# EAGLE design MCU_v3 (EAGLE 7.1.0)
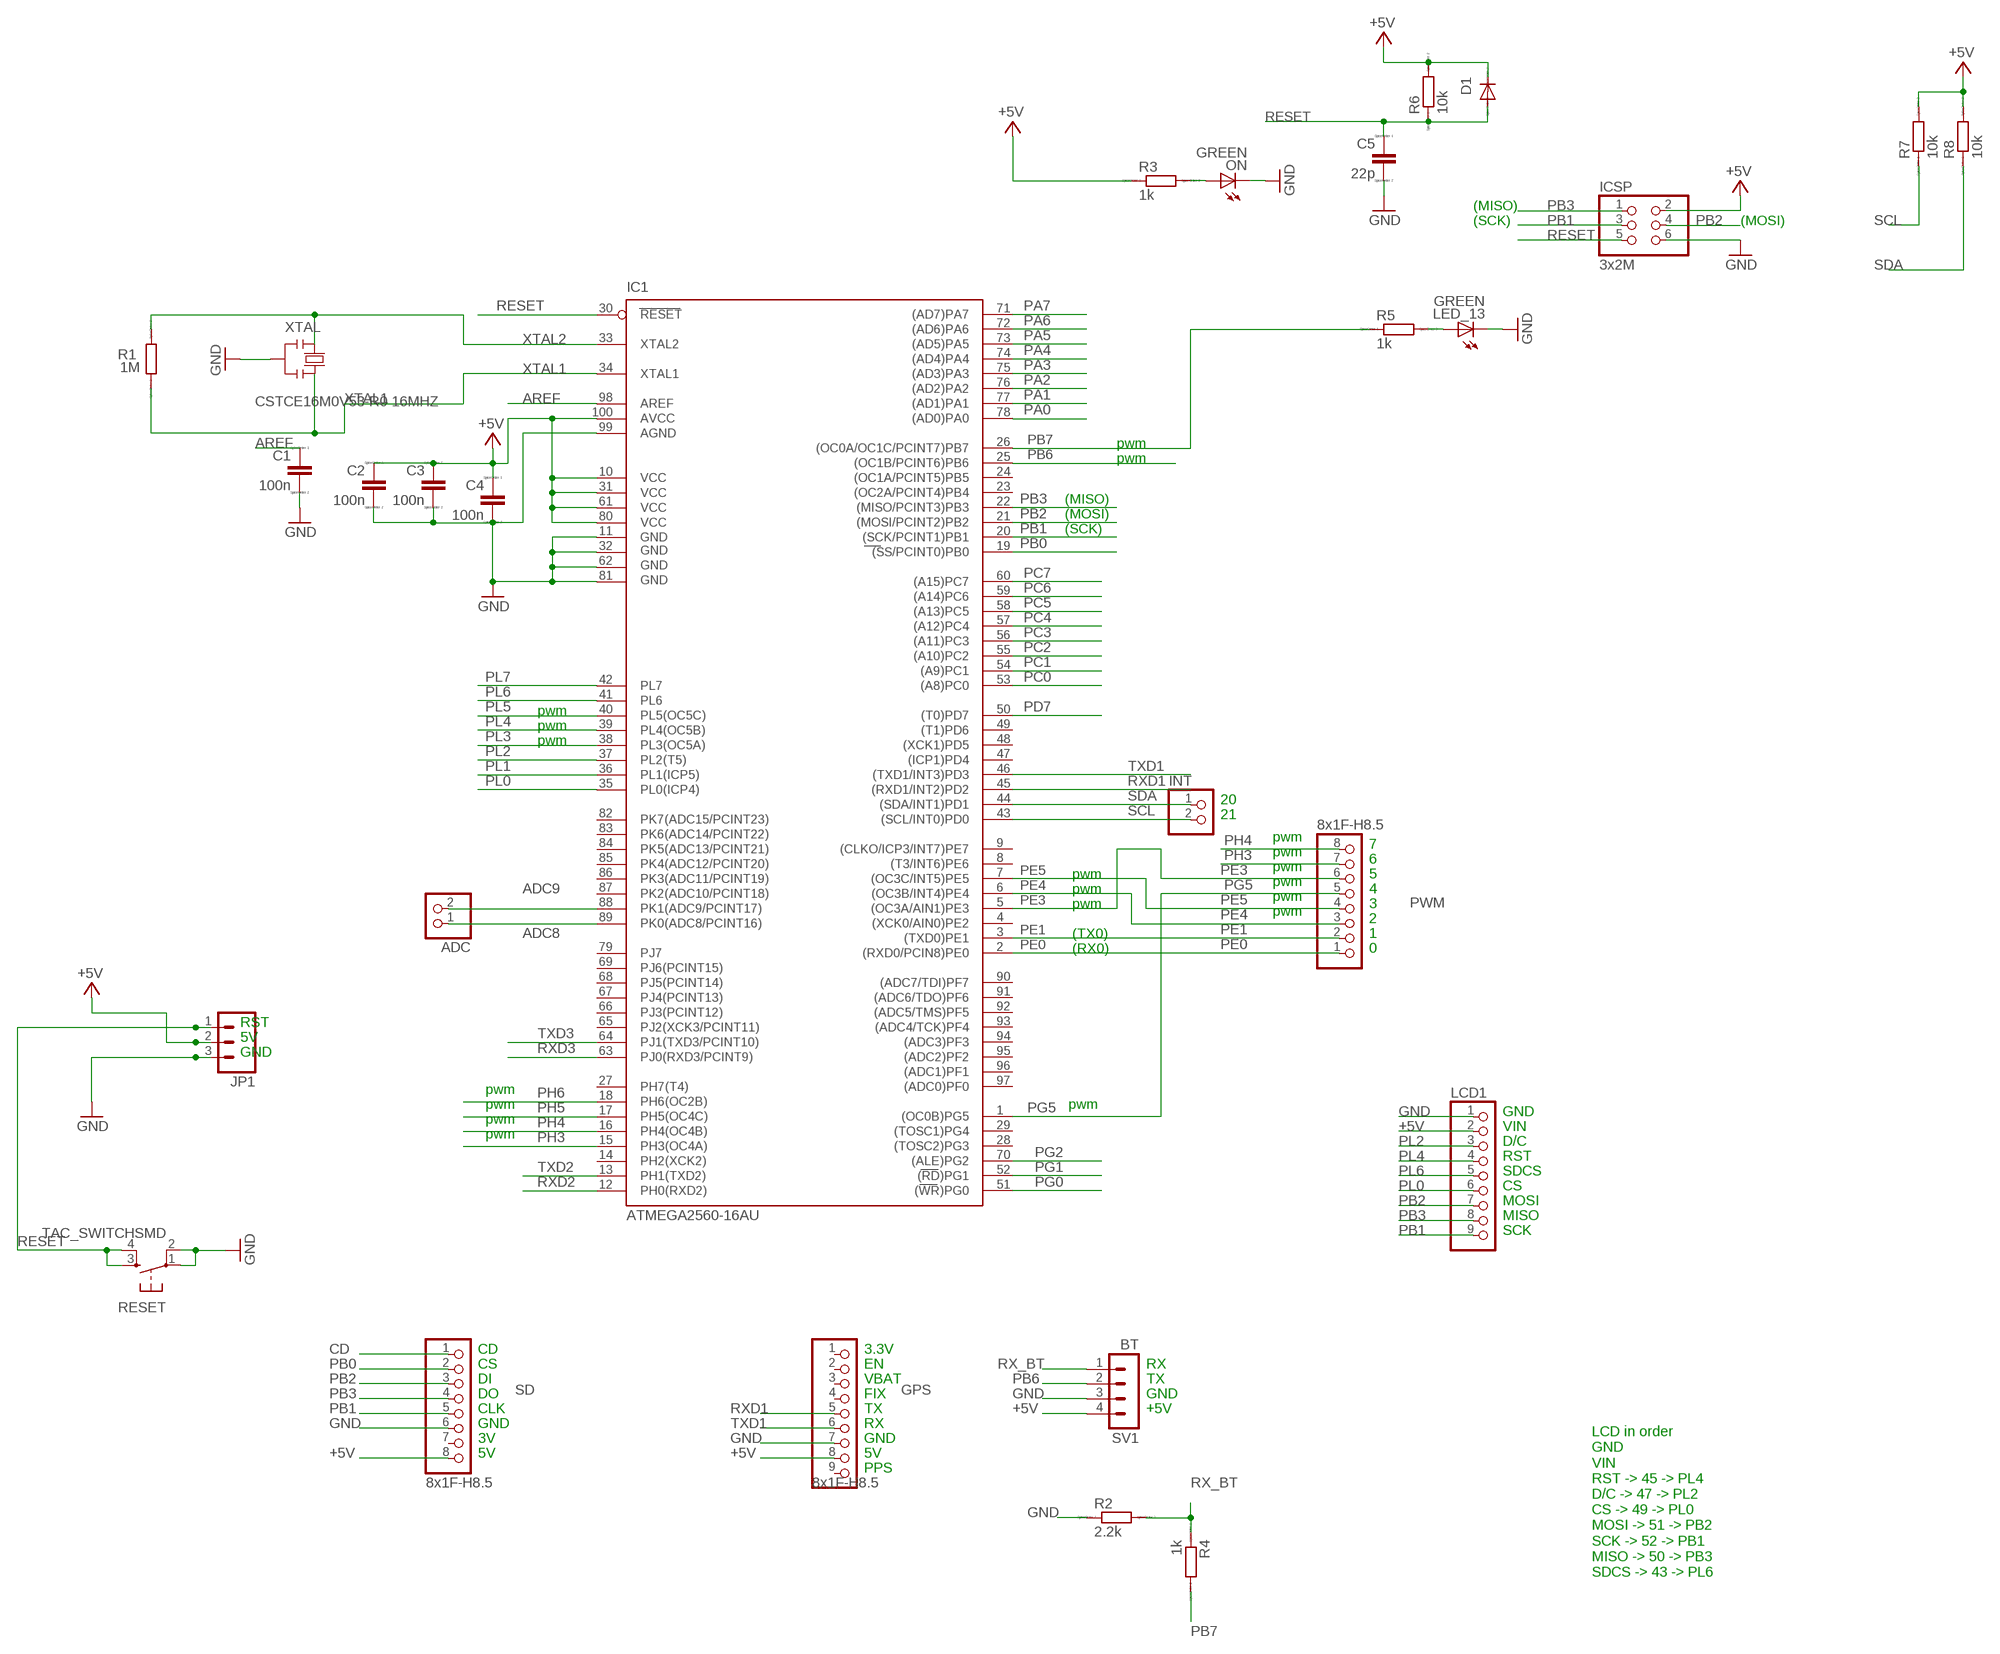
[diagram p0: schematic, sheet 1]

## Parts
ADC  PINHD-1X2  [1X02]
C1  100n  C-EUC0805  [C0805]
C2  100n  C-EUC0805  [C0805]
C3  100n  C-EUC0805  [C0805]
C4  100n  C-EUC0805  [C0805]
C5  22p  C-EUC0805  [C0805]
D1  DIODE-MINIMELF  [MINIMELF]
GPS  8x1F-H8.5  PINHD-1X9  [1X09]
IC1  ATMEGA2560-16AU  ATMEGA25602560-16AU  [TQFP100]
ICSP  3x2M  PINHD-2X3  [2X03]
INT  PINHD-1X2  [1X02]
JP1  M03PTH  [1X03]
LCD1  PINHD-1X9  [1X09]
LED_13  GREEN  LEDCHIP-LED0805  [CHIP-LED0805]
ON  GREEN  LEDCHIP-LED0805  [CHIP-LED0805]
PWM  8x1F-H8.5  PINHD-1X8  [1X08]
R1  1M  R-EU_R0805  [R0805]
R2  2.2k  R-EU_R0805  [R0805]
R3  1k  R-EU_R0805  [R0805]
R4  1k  R-EU_R0805  [R0805]
R5  1k  R-EU_R0805  [R0805]
R6  10k  R-EU_R0805  [R0805]
R7  10k  R-EU_R0805  [R0805]
R8  10k  R-EU_R0805  [R0805]
RESET  TAC_SWITCHSMD  [TACTILE-SWITCH-SMD]
SD  8x1F-H8.5  PINHD-1X8  [1X08]
SV1  BT  MA04-1  [MA04-1]
XTAL  CSTCE16M0V53-R0 16MHZ  RESONATORMU  [RESONATOR]

## Nets
+5V [power usb]: C2.1 C3.1 C4.1 D1.C GPS.8 IC1.10(VCC) IC1.31(VCC1) IC1.61(VCC2) IC1.80(VCC3) IC1.100(AVCC) ICSP.2 JP1.2 LCD1.2 R3.1 R6.2 R7.2 R8.2 SD.8 SV1.4
ADC8: ADC.1 IC1.89(PK0(ADC8/PCINT16))
ADC9: ADC.2 IC1.88(PK1(ADC9/PCINT17))
AREF: C1.1 IC1.98(AREF)
CD: SD.1
GND [gnd]: C1.2 C2.2 C3.2 C4.2 C5.2 GPS.7 IC1.11(GND) IC1.32(GND1) IC1.62(GND2) IC1.81(GND3) IC1.99(AGND) ICSP.6 JP1.3 LCD1.1 LED_13.C ON.C R2.1 RESET.1 RESET.2 SD.6 SV1.3 XTAL.2
N$1: LED_13.A R5.2
N$3: ON.A R3.2
PA0: IC1.78((AD0)PA0)
PA1: IC1.77((AD1)PA1)
PA2: IC1.76((AD2)PA2)
PA3: IC1.75((AD3)PA3)
PA4: IC1.74((AD4)PA4)
PA5: IC1.73((AD5)PA5)
PA6: IC1.72((AD6)PA6)
PA7: IC1.71((AD7)PA7)
PB0: IC1.19((SS/PCINT0)PB0) SD.2
PB1: IC1.20((SCK/PCINT1)PB1) ICSP.3 LCD1.9 SD.5
PB2: IC1.21((MOSI/PCINT2)PB2) ICSP.4 LCD1.7 SD.3
PB3: IC1.22((MISO/PCINT3)PB3) ICSP.1 LCD1.8 SD.4
PB6: IC1.25((OC1B/PCINT6)PB6) SV1.2
PB7: IC1.26((OC0A/OC1C/PCINT7)PB7) R4.2 R5.1
PC0: IC1.53((A8)PC0)
PC1: IC1.54((A9)PC1)
PC2: IC1.55((A10)PC2)
PC3: IC1.56((A11)PC3)
PC4: IC1.57((A12)PC4)
PC5: IC1.58((A13)PC5)
PC6: IC1.59((A14)PC6)
PC7: IC1.60((A15)PC7)
PD7: IC1.50((T0)PD7)
PE0: IC1.2((RXD0/PCIN8)PE0) PWM.1
PE1: IC1.3((TXD0)PE1) PWM.2
PE3: IC1.5((OC3A/AIN1)PE3) PWM.6
PE4: IC1.6((OC3B/INT4)PE4) PWM.3
PE5: IC1.7((OC3C/INT5)PE5) PWM.4
PG0: IC1.51((WR)PG0)
PG1: IC1.52((RD)PG1)
PG2: IC1.70((ALE)PG2)
PG5: IC1.1((OC0B)PG5) PWM.5
PH3: IC1.15(PH3(OC4A)) PWM.7
PH4: IC1.16(PH4(OC4B)) PWM.8
PH5: IC1.17(PH5(OC4C))
PH6: IC1.18(PH6(OC2B))
PL0: IC1.35(PL0(ICP4)) LCD1.6
PL1: IC1.36(PL1(ICP5))
PL2: IC1.37(PL2(T5)) LCD1.3
PL3: IC1.38(PL3(OC5A))
PL4: IC1.39(PL4(OC5B)) LCD1.4
PL5: IC1.40(PL5(OC5C))
PL6: IC1.41(PL6) LCD1.5
PL7: IC1.42(PL7)
RESET: C5.1 D1.A IC1.30(RESET) ICSP.5 JP1.1 R6.1 RESET.3 RESET.4
RX_BT: R2.2 R4.1 SV1.1
RXD1: GPS.5 IC1.45((RXD1/INT2)PD2)
RXD2: IC1.12(PH0(RXD2))
RXD3: IC1.63(PJ0(RXD3/PCINT9))
SCL: IC1.43((SCL/INT0)PD0) INT.2 R7.1
SDA: IC1.44((SDA/INT1)PD1) INT.1 R8.1
TXD1: GPS.6 IC1.46((TXD1/INT3)PD3)
TXD2: IC1.13(PH1(TXD2))
TXD3: IC1.64(PJ1(TXD3/PCINT10))
XTAL1: IC1.34(XTAL1) R1.1 XTAL.3
XTAL2: IC1.33(XTAL2) R1.2 XTAL.1
Unconnected: GPS.1 GPS.2 GPS.3 GPS.4 GPS.9 IC1.4((XCK0/AIN0)PE2) IC1.8((T3/INT6)PE6) IC1.9((CLKO/ICP3/INT7)PE7) IC1.14(PH2(XCK2)) IC1.23((OC2A/PCINT4)PB4) IC1.24((OC1A/PCINT5)PB5) IC1.27(PH7(T4)) IC1.28((TOSC2)PG3) IC1.29((TOSC1)PG4) IC1.47((ICP1)PD4) IC1.48((XCK1)PD5) IC1.49((T1)PD6) IC1.65(PJ2(XCK3/PCINT11)) IC1.66(PJ3(PCINT12)) IC1.67(PJ4(PCINT13)) IC1.68(PJ5(PCINT14)) IC1.69(PJ6(PCINT15)) IC1.79(PJ7) IC1.82(PK7(ADC15/PCINT23)) IC1.83(PK6(ADC14/PCINT22)) IC1.84(PK5(ADC13/PCINT21)) IC1.85(PK4(ADC12/PCINT20)) IC1.86(PK3(ADC11/PCINT19)) IC1.87(PK2(ADC10/PCINT18)) IC1.90((ADC7/TDI)PF7) IC1.91((ADC6/TDO)PF6) IC1.92((ADC5/TMS)PF5) IC1.93((ADC4/TCK)PF4) IC1.94((ADC3)PF3) IC1.95((ADC2)PF2) IC1.96((ADC1)PF1) IC1.97((ADC0)PF0) SD.7

## Notes on the sheet
- (MISO)
- (SCK) | (MOSI)
- pwm
- pwm
- (MISO)
- (MOSI)
- (SCK)
- pwm
- pwm
- pwm
- 20
- 21
- pwm
- 7
- pwm
- 6
- pwm
- pwm | 5
- pwm
- pwm | 4
- pwm
- pwm | 3
- pwm
- 2
- (TX0) | 1
- (RX0) | 0
- RST
- 5V
- GND
- pwm
- pwm | pwm
- GND
- pwm
- VIN
- pwm
- D/C
- RST
- SDCS
- CS
- MOSI
- MISO
- SCK
- CD | 3.3V
- CS | EN | RX
- DI | VBAT | TX
- DO | FIX | GND
- CLK | TX | +5V
- GND | RX
- 3V | GND
- 5V | 5V
- PPS
- LCD in order
  GND
  VIN
  RST -> 45 -> PL4
  D/C -> 47 -> PL2
  CS -> 49 -> PL0
  MOSI -> 51 -> PB2
  SCK -> 52 -> PB1
  MISO -> 50 -> PB3
  SDCS -> 43 -> PL6

## Library data of the parts
ADC INT = pinhead:PINHD-1X2: PIN HEADER; MPN: A21-X0-22-507-115-E; OC_NEWARK: 01Y3075
C1-C5 = resistor:C-EU: CAPACITOR, European symbol; OC_NEWARK: unknown; SPICEPREFIX: C
D1 = diode:DIODE-: DIODE; OC_NEWARK: unknown
GPS LCD1 = pinhead:PINHD-1X9: PIN HEADER; OC_NEWARK: unknown
IC1 = SmartPrj:ATMEGA2560: MICROCONTROLLER 64/128/256 Kbytes FLASH 4 Kbytes EEPROM 8 Kbytes SRAM 86 General Purpose I/O pins 12-channels16-bit PWM 4 x Serial USARTs 16-channels 10-bit A/D; OC_NEWARK: unknown
ICSP = SmartPrj:PINHD-2X3: PIN HEADER; OC_NEWARK: unknown
JP1 = SparkFun-Connectors:M03: Header 3 Standard 3-pin 0.1" header. Use with straight break away headers (SKU : PRT-00116), right angle break away headers (PRT-00553), swiss pins (PRT-00743), machine pins (PRT-00117), and female headers (PRT-00115). Molex polarized connector foot print use with SKU : PRT-08232 with associated crimp pins and housings.; MPN: BI2-Q10S-AZ31X-0.3M-SB3T; OC_NEWARK: 31Y7711
LED_13 ON = led:LED: LED OSRAM: - CHIPLED LG R971, LG N971, LY N971, LG Q971, LY Q971, LO R971, LY R971 LH N974, LH R974 LS Q976, LO Q976, LY Q976 LO Q996 - Hyper CHIPLED LW Q18S LB Q993, LB Q99A, LB R99A - SideLED LS A670, LO A670, LY A670, LG A670, LP A670 LB A673, LV A673, LT A673, LW A673 LH A674 LY A675 LS A676, LA A676, LO A676, LY A676, LW A676 LS A679, LY A679, LG A679 - Hyper Micro SIDELED® LS Y876, LA Y876, LO Y876, LY Y876 LT Y87S - SmartLED LW L88C, LW L88S LB L89C, LB L89S, LG L890 LS L89K, LO L89K, LY L89K LS L896, LA L896, LO L896, LY L896 - TOPLED LS T670, LO T670, LY T670, LG T670, LP T670 LSG T670, LSP T670, LSY T670, LOP T670, LYG T670 LG T671, LOG T671, LSG T671 LB T673, LV T673, LT T673, LW T673 LH T674 LS T676, LA T676, LO T676, LY T676, LB T676, LH T676, LSB T676, LW T676 LB T67C, LV T67C, LT T67C, LS T67K, LO T67K, LY T67K, LW E67C LS E67B, LA E67B, LO E67B, LY E67B, LB E67C, LV E67C, LT E67C LW T67C LS T679, LY T679, LG T679 LS T770, LO T770, LY T770, LG T770, LP T770 LB T773, LV T773, LT T773, LW T773 LH T774 LS E675, LA E675, LY E675, LS T675 LS T776, LA T776, LO T776, LY T776, LB T776 LHGB T686 LT T68C, LB T68C - Hyper Mini TOPLED® LB M676 - Mini TOPLED Santana® LG M470 LS M47K, LO M47K, LY M47K Source: http://www.osram.convergy.de LUXEON: - LUMILED® LXK2-PW12-R00, LXK2-PW12-S00, LXK2-PW14-U00, LXK2-PW14-V00 LXK2-PM12-R00, LXK2-PM12-S00, LXK2-PM14-U00 LXK2-PE12-Q00, LXK2-PE12-R00, LXK2-PE12-S00, LXK2-PE14-T00, LXK2-PE14-U00 LXK2-PB12-K00, LXK2-PB12-L00, LXK2-PB12-M00, LXK2-PB14-N00, LXK2-PB14-P00, LXK2-PB14-Q00 LXK2-PR12-L00, LXK2-PR12-M00, LXK2-PR14-Q00, LXK2-PR14-R00 LXK2-PD12-Q00, LXK2-PD12-R00, LXK2-PD12-S00 LXK2-PH12-R00, LXK2-PH12-S00 LXK2-PL12-P00, LXK2-PL12-Q00, LXK2-PL12-R00 Source: www.luxeon.com KINGBRIGHT: KA-3528ASYC Source: www.kingbright.com; OC_NEWARK: unknown
PWM SD = SmartPrj:PINHD-1X8: PIN HEADER; OC_NEWARK: unknown
R1-R8 = resistor:R-EU_: RESISTOR, European symbol; OC_NEWARK: unknown; SPICEPREFIX: R
RESET = SparkFun-Retired:TAC_SWITCH: Momentary Switch Button commonly used for reset or general input. Spark Fun Electronics SKU : COM-00097 SMT- SWCH-08247; OC_NEWARK: unknown; PROD_ID: SWCH-08247
SV1 = con-lstb:MA04-1: PIN HEADER; OC_FARNELL: unknown; OC_NEWARK: unknown
XTAL = SmartPrj:RESONATOR; OC_NEWARK: unknown

## Net classes
0 default: width 0.203 mm, drill 0.406 mm, clearance 0.203 mm
1 power: width 0.305 mm, drill 0.406 mm, clearance 0.203 mm
2 gnd: width 0.305 mm, drill 0.406 mm, clearance 0.203 mm
3 power usb: width 0.305 mm, drill 0.406 mm, clearance 0.203 mm

## Board
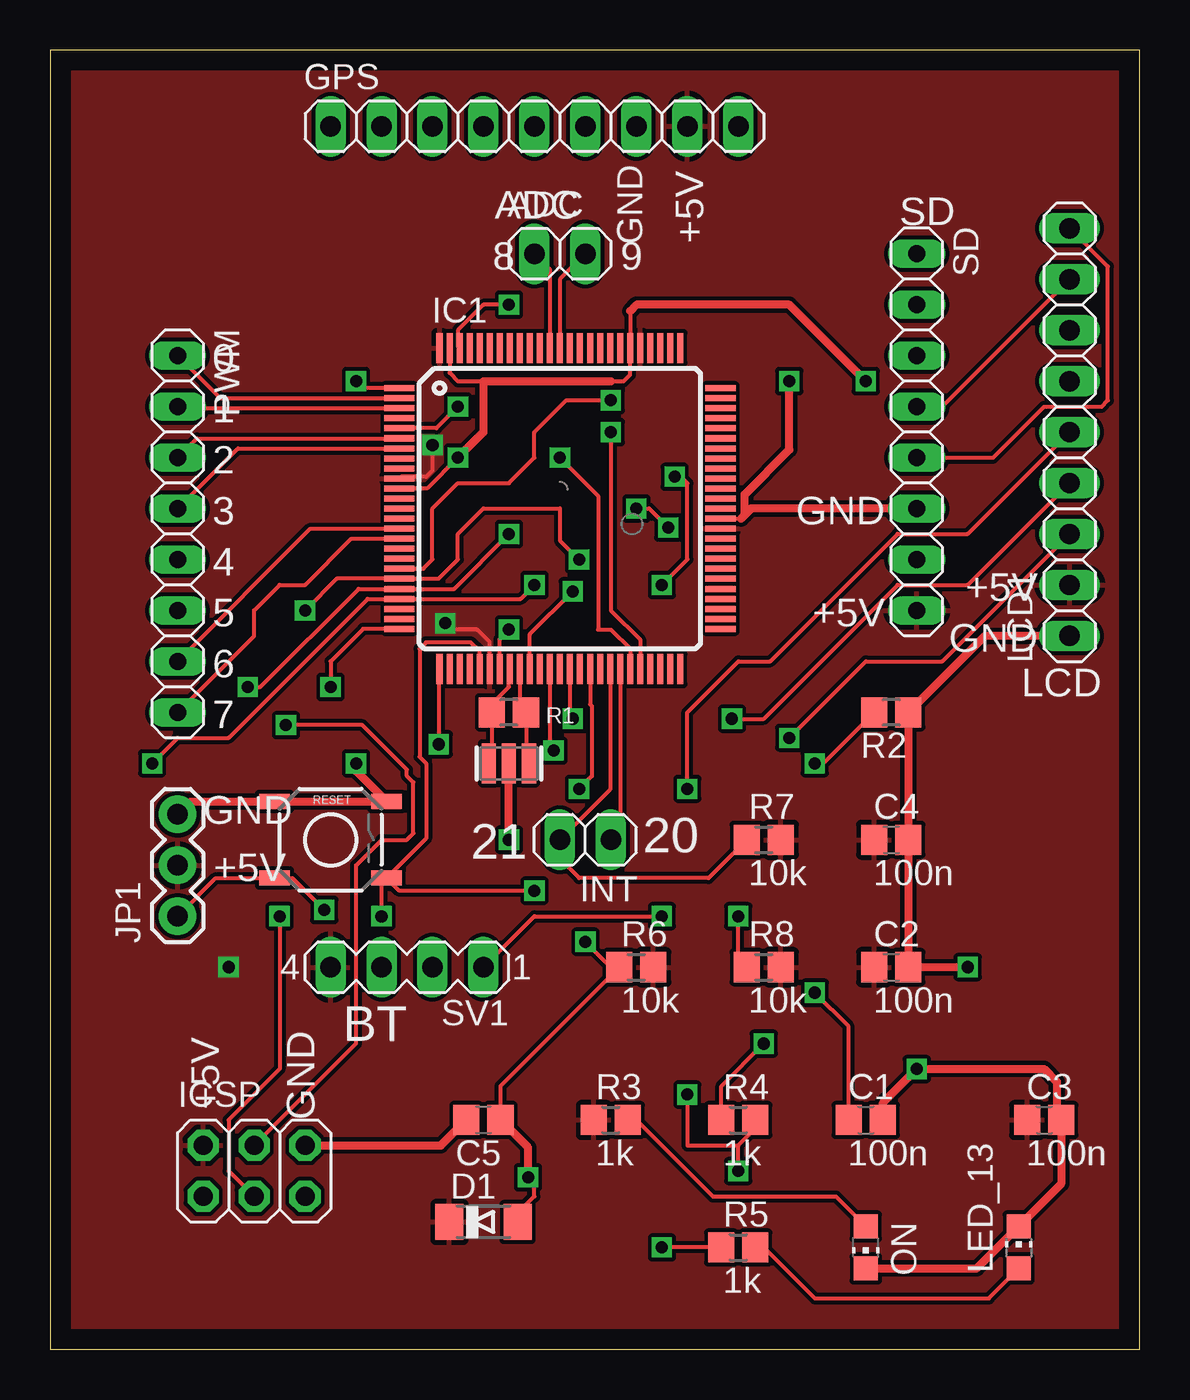
[diagram p1: board, top side]
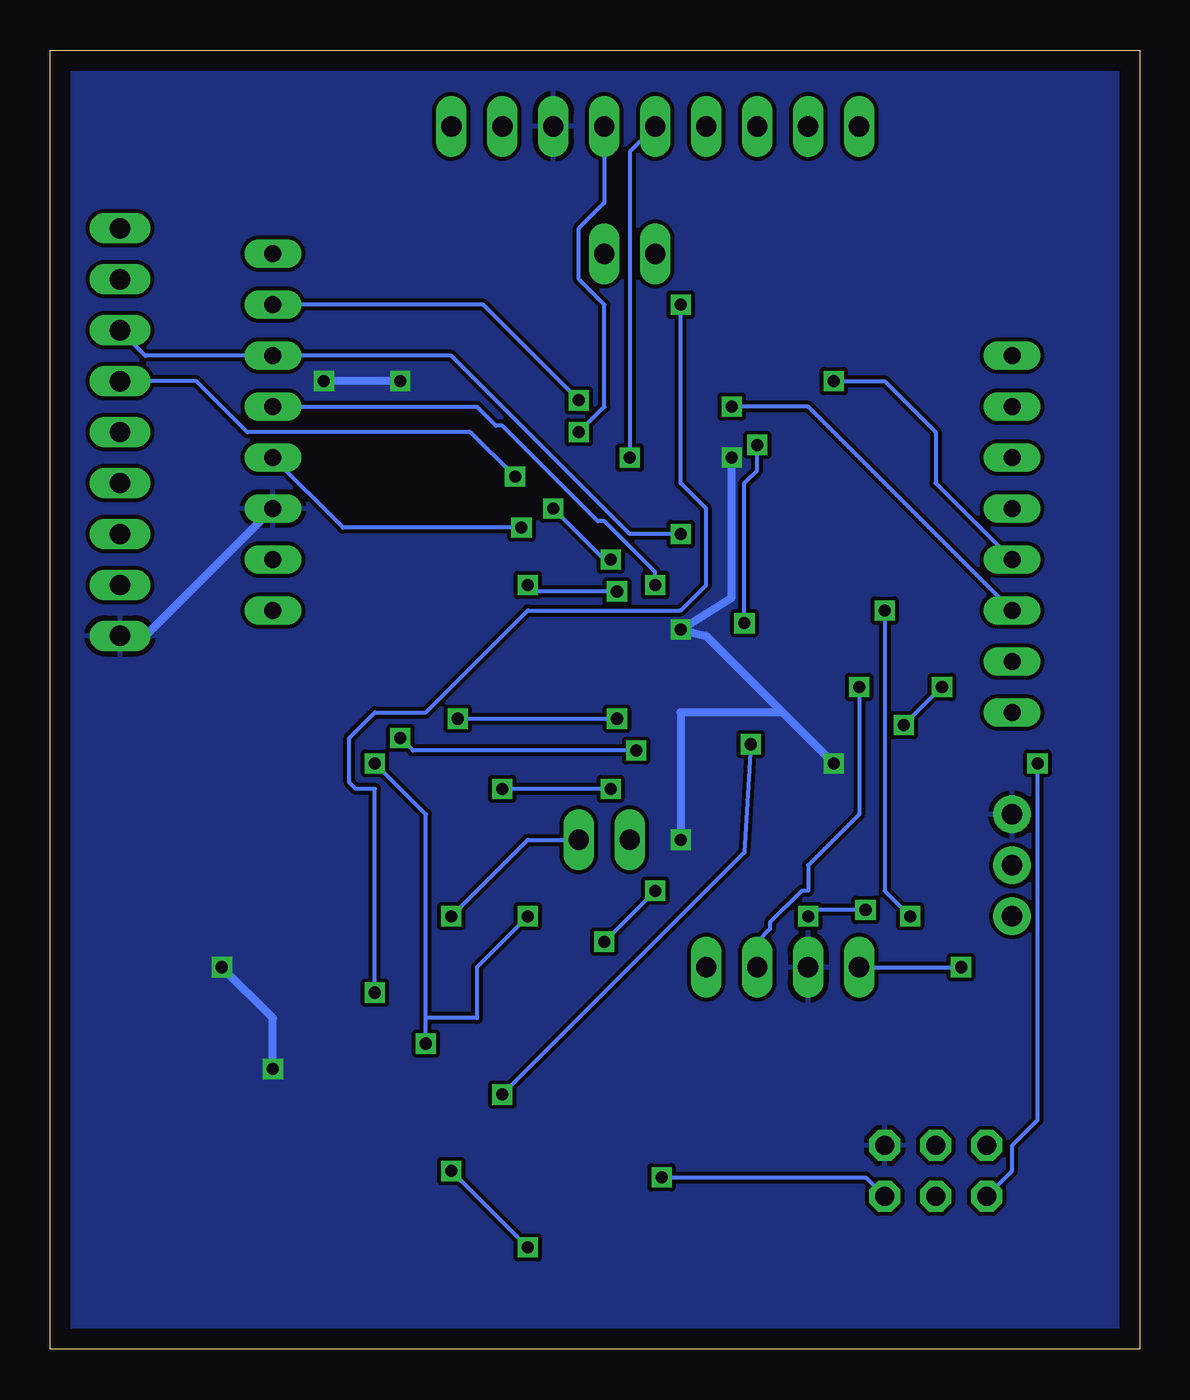
[diagram p2: board, bottom side, seen from below]

Size 54.28 x 64.76 mm. Coordinates in mm from the lower left corner, seen from the top.
Outline: 0,0 54.28,0 54.28,64.76 0,64.76 0,0
Copper layers (1*16): Top 0.035mm / dielectric 1.5mm / Bottom 0.035mm
Design rules "default": minimum track width 10mil, minimum drill 24mil, track to track 8mil, track to pad 8mil, pad to pad 8mil, via to via 8mil, smd to smd 8mil, copper to edge 40mil, drill to drill 8mil, minimum pad ring 10mil, minimum via ring 8mil, stop-mask expansion 4mil, vias tented up to drill 0mil, thermal gap 10mil

### Footprints (pad centres in the part's own frame; a part is rotated, then mirrored left to right if it is on the bottom)
1X02 = drill 1.016 long: 1 -1.27,0; 2 1.27,0
C0805 = smd 1.3 x 1.5: 1 -0.85,0; 2 0.85,0
MINIMELF = smd 1.4 x 1.8: A 1.7,0; C -1.7,0
1X09 = drill 1.016 long: 1 -10.16,0; 2 -7.62,0; 3 -5.08,0; 4 -2.54,0; 5 0,0; 6 2.54,0; 7 5.08,0; 8 7.62,0; 9 10.16,0
TQFP100 = smd 1.5 x 0.3: 1 -8,6; 2 -8,5.5; 3 -8,5; 4 -8,4.5; 5 -8,4; 6 -8,3.5; 7 -8,3; 8 -8,2.5; 9 -8,2; 10 -8,1.5; 11 -8,1; 12 -8,0.5; 13 -8,0; 14 -8,-0.5; 15 -8,-1; 16 -8,-1.5; 17 -8,-2; 18 -8,-2.5; 19 -8,-3; 20 -8,-3.5; 21 -8,-4; 22 -8,-4.5; 23 -8,-5; 24 -8,-5.5; 25 -8,-6; 51 8,-6; 52 8,-5.5; 53 8,-5; 54 8,-4.5; 55 8,-4; 56 8,-3.5; 57 8,-3; 58 8,-2.5; 59 8,-2; 60 8,-1.5; 61 8,-1; 62 8,-0.5; 63 8,0; 64 8,0.5; 65 8,1; 66 8,1.5; 67 8,2; 68 8,2.5; 69 8,3; 70 8,3.5; 71 8,4; 72 8,4.5; 73 8,5; 74 8,5.5; 75 8,6 | smd 0.3 x 1.5: 26 -6,-8; 27 -5.5,-8; 28 -5,-8; 29 -4.5,-8; 30 -4,-8; 31 -3.5,-8; 32 -3,-8; 33 -2.5,-8; 34 -2,-8; 35 -1.5,-8; 36 -1,-8; 37 -0.5,-8; 38 0,-8; 39 0.5,-8; 40 1,-8; 41 1.5,-8; 42 2,-8; 43 2.5,-8; 44 3,-8; 45 3.5,-8; 46 4,-8; 47 4.5,-8; 48 5,-8; 49 5.5,-8; 50 6,-8; 76 6,8; 77 5.5,8; 78 5,8; 79 4.5,8; 80 4,8; 81 3.5,8; 82 3,8; 83 2.5,8; 84 2,8; 85 1.5,8; 86 1,8; 87 0.5,8; 88 0,8; 89 -0.5,8; 90 -1,8; 91 -1.5,8; 92 -2,8; 93 -2.5,8; 94 -3,8; 95 -3.5,8; 96 -4,8; 97 -4.5,8; 98 -5,8; 99 -5.5,8; 100 -6,8
2X03 = drill 0.95 pad 1.55 octagon: 1 -2.54,-1.27; 2 -2.54,1.27; 3 0,-1.27; 4 0,1.27; 5 2.54,-1.27; 6 2.54,1.27
1X03 = drill 1.016 pad 1.88: 1 0,0; 2 2.54,0; 3 5.08,0
CHIP-LED0805 = smd 1.2 x 1.2: A 0,-1.05; C 0,1.05
1X08 = drill 0.85 pad 1.422 long: 1 -8.89,0; 2 -6.35,0; 3 -3.81,0; 4 -1.27,0; 5 1.27,0; 6 3.81,0; 7 6.35,0; 8 8.89,0
R0805 = smd 1.3 x 1.5: 1 -0.85,0; 2 0.85,0
TACTILE-SWITCH-SMD = smd 1.524 x 0.762: 1 -2.794,1.905; 2 2.794,1.905; 3 -2.794,-1.905; 4 2.794,-1.905
MA04-1 = drill 1.016 long: 1 -3.81,0; 2 -1.27,0; 3 1.27,0; 4 3.81,0
RESONATOR = smd 0.7 x 2: 1 -1,0; 2 0,0; 3 1,0

### Placement (x,y rotation side)
ADC  25.4,54.61 0 top
C1  40.64,11.43 0 top
C2  41.91,19.05 0 top
C3  49.53,11.43 0 top
C4  41.91,25.4 0 top
C5  21.59,11.43 180 top
D1  21.59,6.35 0 top
GPS  24.13,60.96 0 top
IC1  25.4,41.91 0 top
ICSP  10.16,8.89 0 top
INT  26.67,25.4 180 top
JP1  6.35,21.59 90 top
LCD1  50.8,45.72 90 top
LED_13  48.26,5.08 0 top
ON  40.64,5.08 180 top
PWM  6.35,40.64 270 top
R1  22.86,31.75 180 top
R2  41.91,31.75 180 top
R3  27.94,11.43 0 top
R4  34.29,11.43 0 top
R5  34.29,5.08 0 top
R6  29.21,19.05 0 top
R7  35.56,25.4 0 top
R8  35.56,19.05 0 top
RESET  13.97,25.4 0 top
SD  43.18,45.72 270 top
SV1  17.78,19.05 180 top
XTAL  22.86,29.21 0 top

### Tracks (layer width: path | path; a pad name or v marks a point on that pad's centre or on a via)
+5V  (via drill 0.6)
  Top 0.203: v8.89,19.05 8.57,19.05 | IC1.31 21.9,35.25 21.27,35.88 20,35.88 v19.69,36.2 | v19.05,45.09 19.05,43.81 18.73,43.5 17.49,43.5 IC1.10
  Bottom 0.203: SV1.4 v8.89,19.05 | v19.69,36.2 19.69,43.18 19.05,43.81 v19.05,45.09
  pour Top: -1.27,66.04 57.15,66.04 57.15,-1.27 -1.27,-1.27
ADC8
  Top 0.203: ADC.1 24.9,53.84 IC1.89
ADC9
  Top 0.203: ADC.2 25.4,53.34 IC1.88
AREF  (via drill 0.6)
  Top 0.203: C1.1 39.79,16.09 v38.1,17.78 | v22.86,52.07 21.59,52.07 20.32,50.8 20.32,49.99 IC1.98
  Bottom 0.203: v38.1,17.78 38.1,27.94 39.05,27.94 39.37,28.26 39.37,30.48 38.1,31.75 35.56,31.75 30.48,36.83 22.86,36.83 21.59,38.1 21.59,41.91 22.86,43.18 v22.86,52.07
GND  (via drill 0.6)
  Top 0.203: 28.9,51.76 IC1.81 | IC1.32 22.4,35.38 v22.86,35.88 | v20.32,44.45 18.78,42.91 IC1.11 | IC1.99 19.9,48.68 20.32,48.26 21.59,48.26 | 28.9,49.22 IC1.81 | IC1.62 34.42,41.41 34.61,41.59 | 27.94,48.26 28.58,48.26 28.89,48.58 IC1.81
  Top 0.406: C1.2 41.49,12.28 v43.18,13.97 49.53,13.97 50.16,13.33 50.16,11.64 C3.2 50.38,8.25 LED_13.C 46.16,4.03 ON.C | v45.72,19.05 C2.2 C4.2 R2.1 46.57,35.56 LCD1.1 | v36.83,48.26 36.83,44.84 34.61,42.62 34.61,41.59 | v40.64,48.26 36.83,52.07 29.21,52.07 28.9,51.76 | JP1.3 6.98,27.3 RESET.1 RESET.2 15.24,28.83 v15.24,29.21 | v22.86,25.4 XTAL.2 | v20.32,44.45 21.59,45.72 21.59,48.26 27.94,48.26 | SD.6 34.92,41.91 34.42,41.41 | ICSP.6 19.47,10.16 C5.2
  Bottom 0.406: v43.18,13.97 43.18,16.51 v45.72,19.05 | v36.83,48.26 v40.64,48.26 | v15.24,29.21 17.78,31.75 | 17.78,31.75 22.86,31.75 v22.86,25.4 | 17.78,31.75 21.59,35.56 v22.86,35.88 20.32,37.46 v20.32,44.45 | LCD1.1 49.53,35.56 SD.6
  pour Bottom: -2.54,68.58 57.15,68.58 57.15,-3.81 -2.54,-3.81
N$1
  Top 0.203: R5.2 35.56,5.08 38.1,2.54 46.77,2.54 LED_13.A
N$3
  Top 0.203: R3.2 29.21,11.43 33.02,7.62 39.15,7.62 ON.A
PB0  (via drill 0.6)
  Top 0.203: IC1.19 18.59,38.91 19.05,39.37 19.05,41.91 20.32,43.18 22.86,43.18 24.13,44.45 24.13,45.72 25.72,47.31 v27.94,47.31
  Bottom 0.203: v27.94,47.31 32.7,52.07 SD.2
PB1  (via drill 0.6)
  Top 0.203: v12.7,36.83 14.28,38.41 IC1.20 19.36,38.41 20.32,39.37 20.32,40.64 21.59,41.91 25.4,41.91 25.4,40.32 v26.35,39.37 | v11.43,21.59 11.43,13.97 8.89,11.43 8.89,8.89 ICSP.3 | SD.5 46.99,44.45 49.53,46.99 52.39,46.99 52.7,47.31 52.7,53.97 LCD1.9 | v29.21,41.91 29.84,41.91 v30.8,40.96
  Bottom 0.203: v12.7,36.83 12.7,22.86 v11.43,21.59 | v26.35,39.37 26.67,39.37 v29.21,41.91 | v30.8,40.96 39.69,40.96 SD.5
PB2  (via drill 0.6)
  Top 0.203: ICSP.4 15.24,15.24 15.24,24.13 16.51,25.4 17.78,25.4 18.1,25.72 18.1,28.26 17.78,28.57 17.78,28.89 15.56,31.11 v11.75,31.11 | v9.84,33.02 10.48,33.02 15.37,37.91 IC1.21 20.13,37.91 v22.86,40.64
  Bottom 0.203: LCD1.7 49.53,49.53 SD.3 34.29,49.53 25.4,40.64 v22.86,40.64 | v11.75,31.11 v9.84,33.02
PB3  (via drill 0.6)
  Top 0.203: v5.08,29.21 6.35,30.48 8.89,30.48 15.82,37.41 IC1.22 23.44,37.41 v24.13,38.1 | SD.4 44.45,46.99 LCD1.8
  Bottom 0.203: ICSP.1 6.35,8.89 6.35,10.16 5.08,11.43 v5.08,29.21 | SD.4 33.02,46.99 32.07,46.04 31.75,46.04 26.99,41.27 26.67,41.27 24.13,38.73 v24.13,38.1
PB6  (via drill 0.6)
  Top 0.203: IC1.25 15.59,35.91 13.97,34.29 v13.97,33.02
  Bottom 0.203: v13.97,33.02 13.97,26.67 16.51,24.13 16.51,22.86 16.83,22.86 18.41,21.27 18.41,20.96 19.05,20.32 SV1.2
PB7  (via drill 0.6)
  Top 0.203: R5.1 v30.48,5.08 | v34.29,8.89 34.29,10.16 | IC1.26 19.37,33.88 v19.37,30.16 | v31.75,12.7 31.75,10.16 34.29,10.16 | 34.29,10.16 35.14,11.01 R4.2
  Bottom 0.203: v30.48,5.08 v34.29,8.89 | v19.37,30.16 19.69,24.77 v31.75,12.7
PE0
  Top 0.203: PWM.1 8.47,47.41 IC1.2
PE1
  Top 0.203: PWM.2 6.43,46.91 IC1.3
PE3  (via drill 0.6)
  Top 0.203: v20.32,46.99 19.24,45.91 IC1.5
  Bottom 0.203: PWM.6 16.51,46.99 v20.32,46.99
PE4
  Top 0.203: PWM.3 7.31,45.41 IC1.6
PE5
  Top 0.203: PWM.4 9.35,44.91 IC1.7
PG5  (via drill 0.6)
  Top 0.203: IC1.1 15.59,47.91 v15.24,48.26
  Bottom 0.203: v15.24,48.26 12.7,48.26 10.16,45.72 10.16,43.18 PWM.5
PH3
  Top 0.203: PWM.7 12.97,40.91 IC1.15
PH4
  Top 0.203: IC1.16 15.01,40.41 12.7,38.1 11.43,38.1 10.16,36.83 10.16,35.56 PWM.8
PL0  (via drill 0.6)
  Top 0.203: IC1.35 23.9,35.65 v26.03,37.78 | v30.48,38.1 31.75,39.37 31.75,43.18 31.43,43.5 v31.11,43.5
  Bottom 0.203: LCD1.6 46.99,48.26 44.45,45.72 33.34,45.72 v31.11,43.5 | v26.03,37.78 30.16,37.78 v30.48,38.1
PL2  (via drill 0.6)
  Top 0.203: IC1.37 24.9,30.03 v25.08,29.85 | v36.83,30.48 40.64,34.29 44.45,34.29 LCD1.3
  Bottom 0.203: v25.08,29.85 36.19,29.85 v36.83,30.48
PL4  (via drill 0.6)
  Top 0.203: IC1.39 25.9,31.57 v26.03,31.43 | v33.97,31.43 35.56,31.43 42.23,38.1 45.72,38.1 LCD1.4
  Bottom 0.203: v26.03,31.43 v33.97,31.43
PL6  (via drill 0.6)
  Top 0.203: IC1.41 26.9,32.16 26.99,32.07 26.99,28.57 v26.35,27.94 | v31.75,27.94 31.75,31.75 34.29,34.29 35.88,34.29 42.23,40.64 45.72,40.64 LCD1.5
  Bottom 0.203: v26.35,27.94 v31.75,27.94
RESET  (via drill 0.6)
  Top 0.203: JP1.1 8.25,23.5 RESET.3 12.06,23.5 v13.65,21.91 | D1.A 23.29,6.78 24.13,7.62 24.13,8.25 v23.81,8.57 | C5.1 22.44,13.13 R6.1 27.94,19.05 v26.67,20.32 | v24.13,22.86 17.4,22.86 RESET.4 | v16.51,21.59 16.51,23.24 RESET.4 | IC1.30 21.4,34.8 20.95,35.24 18.73,35.24 18.41,34.92 18.41,29.53 18.73,29.21 18.73,25.46 RESET.4
  Top 0.406: v23.81,8.57 23.81,10.06 C5.1
  Bottom 0.203: v23.81,8.57 13.65,8.57 ICSP.5 | v26.67,20.32 v24.13,22.86 | v13.65,21.91 16.19,21.91 v16.51,21.59
RX_BT  (via drill 0.6)
  Top 0.203: R4.1 33.44,13.12 v35.56,15.24 | v38.1,29.21 38.52,29.21 R2.2 | SV1.1 24.13,21.59 v30.48,21.59
  Bottom 0.203: v35.56,15.24 35.56,16.51 | 35.56,16.51 35.56,26.67 v38.1,29.21 | v30.48,21.59 33.02,19.05 33.02,16.51 35.56,16.51
RXD1  (via drill 0.6)
  Top 0.203: v25.4,44.45 27.3,42.54 27.3,35.88 27.94,35.88 28.89,34.92 IC1.45
  Bottom 0.203: GPS.5 25.4,59.69 v25.4,44.45
SCL
  Top 0.203: IC1.43 27.9,27.9 INT.2 25.4,24.45 26.35,23.5 32.8,23.5 R7.1
SDA  (via drill 0.6)
  Top 0.203: IC1.44 28.4,25.86 INT.1 | R8.1 34.29,19.47 v34.29,21.59
  Bottom 0.203: v34.29,21.59 30.48,25.4 INT.1
TXD1  (via drill 0.6)
  Top 0.203: v27.94,45.72 27.94,36.83 29.4,35.37 IC1.46
  Bottom 0.203: GPS.6 26.67,57.15 27.94,55.88 27.94,53.34 26.67,52.07 26.67,46.99 v27.94,45.72
XTAL1
  Top 0.203: IC1.34 23.4,32.06 R1.1 23.71,29.36 XTAL.3
XTAL2
  Top 0.203: XTAL.1 22.01,29.36 R1.2 22.01,32.17 22.86,33.02 22.86,33.87 IC1.33

### Text on the board
tPlace: GND | +5V | ADC | SD | 8 | 9 | 0 | 1 | 2 | 3 | GND | 4 | +5V | 5 | +5V | GND | 6 | LCD | 7 | GND | +5V | 20 | 21 | BT | GND | +5V